# Altium schematic sheet ADL5545WideBandAmp.SchDoc
size A4
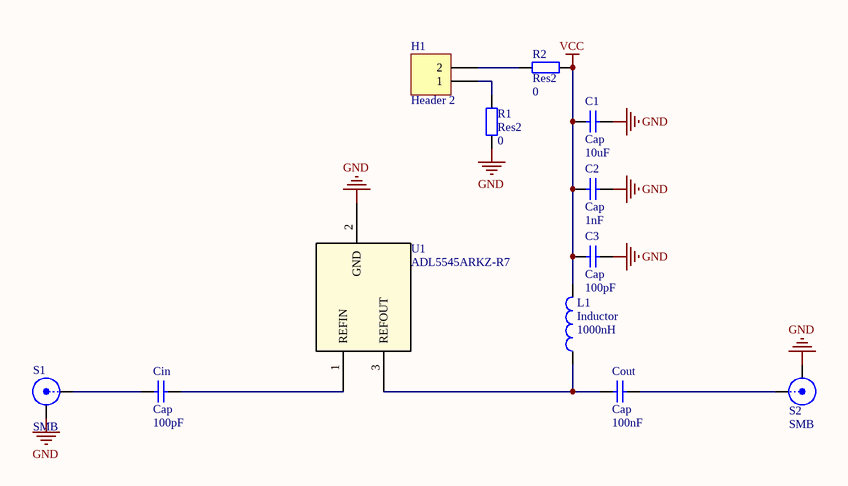
[diagram p0: ADL5545WideBandAmp.SchDoc]

## Parts
C1  Cap  value 10uF  [CAP_SMD_3216]
C2  Cap  value 1nF  [0805C]
C3  Cap  value 100pF  [0805C]
Cin  Cap  value 100pF  [0805C]
Cout  Cap  value 100nF  [0805C]
H1  Header 2  [HDR1X2]
L1  Inductor  value 1000nH  [0805L]
R1  Res2  value 0  [AXIAL-0.4]
R2  Res2  value 0  [AXIAL-0.4]
S1  SMB  [SMB_V-RJ45]
S2  SMB  [SMB_V-RJ45]
U1  ADL5545ARKZ-R7  [RK_3]

## Nets
GND: C1.2 C2.2 C3.2 R1.2 S1.2(Y) S2.2(Y) U1.2(GND)
VCC: C1.1 C2.1 C3.1 L1.2 R2.2
NetCin_1: Cin.1 S1.1(X)
NetCin_2: Cin.2 U1.1(REFIN)
NetCout_1: Cout.1 L1.1 U1.3(REFOUT)
NetCout_2: Cout.2 S2.1(X)
NetH1_1: H1.1 R1.1
NetH1_2: H1.2 R2.1

## Library data of the parts
C1-C3 Cin Cout = Cap: Capacitor; Published: 8-Jun-2000; LatestRevisionDate: 17-Jul-2002; LatestRevisionNote: Re-released for DXP Platform.; PackageReference: RAD-0.3; Publisher: Altium Limited; PackageDescription: Radial Cap, Thru-Hole; 2 Leads; 0.3 in Pin Spacing
H1 = Header 2: Header, 2-Pin; LatestRevisionDate: 17-Jul-2002; LatestRevisionNote: Re-released for DXP Platform.; Publisher: Altium Limited
L1 = Inductor: Code_IEC: 1005; Published: 8-Jun-2000; LatestRevisionDate: 29-May-2009; LatestRevisionNote: IPC-7351 Footprint Added.; PackageReference: 0402-A; Publisher: Altium Limited; PackageDescription: Chip Inductor; Code_JEITA: 0402
R1 R2 = Res2: Resistor; Published: 8-Jun-2000; LatestRevisionDate: 17-Jul-2002; LatestRevisionNote: Re-released for DXP Platform.; PackageReference: AXIAL-0.4; Publisher: Altium Limited; PackageDescription: Axial Device, Thru-Hole; 2 Leads; 0.4 in Pin Spacing
S1 S2 = SMB: SMB Straight Connector; LatestRevisionDate: 17-Jul-2002; LatestRevisionNote: Re-released for DXP Platform.; Publisher: Altium Limited
U1 = ADL5545ARKZ-R7: Imported; Value: Value; Type: Type; RefDes: RefDes